# EAGLE design matchbox_cpu_v12 (EAGLE 7.2.0)
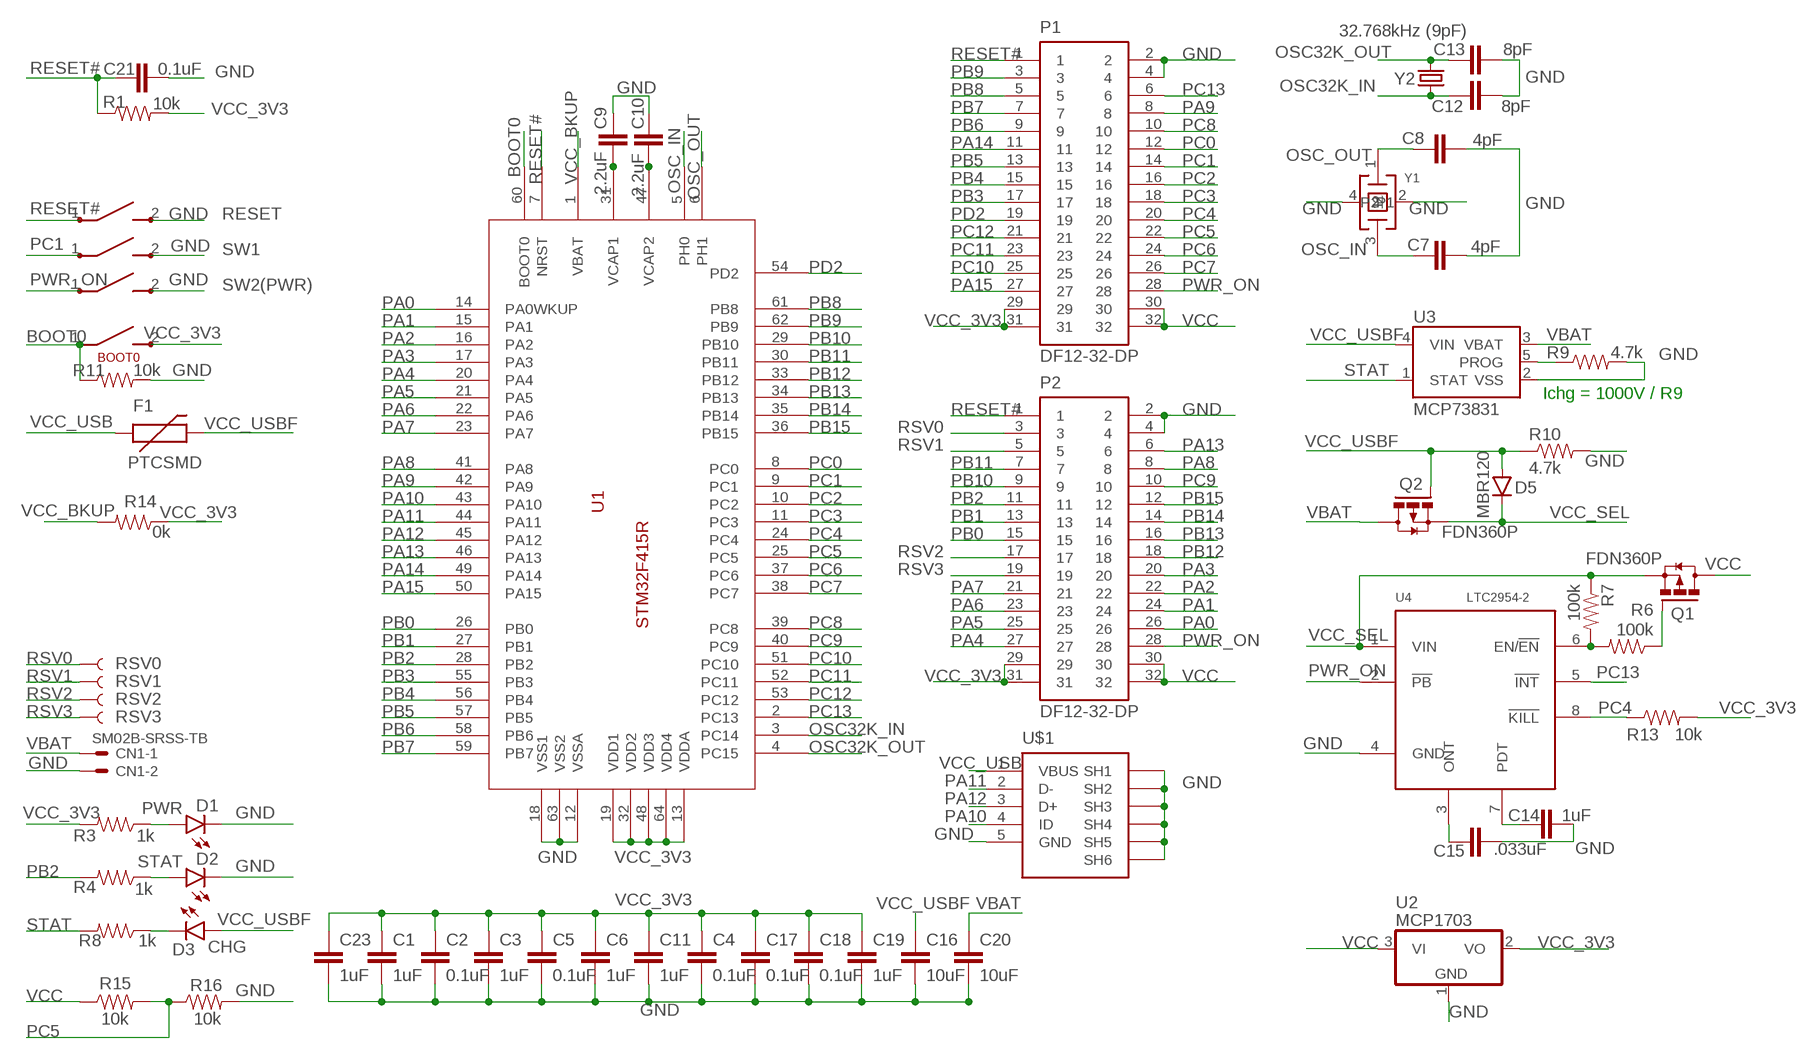
[diagram p0: schematic, sheet 1]

## Parts
BOOT0  B3U-3100PM-B  [B3U-3100PM-B]
C1  1uF  CAP0805  [0805]
C2  0.1uF  CAP0805  [0805]
C3  1uF  CAP0805  [0805]
C4  0.1uF  CAP0805  [0805]
C5  0.1uF  CAP0805  [0805]
C6  1uF  CAP0805  [0805]
C7  4pF  CAP0805  [0805]
C8  4pF  CAP0805  [0805]
C9  2.2uF  CAP0805  [0805]
C10  2.2uF  CAP0805  [0805]
C11  1uF  CAP0805  [0805]
C12  8pF  CAP0805  [0805]
C13  8pF  CAP0805  [0805]
C14  1uF  CAP0805  [0805]
C15  .033uF  CAP0805  [0805]
C16  10uF  CAP0805  [0805]
C17  0.1uF  CAP0805  [0805]
C18  0.1uF  CAP0805  [0805]
C19  1uF  CAP0805  [0805]
C20  10uF  CAP0805  [0805]
C21  0.1uF  CAP0805  [0805]
C23  1uF  CAP0805  [0805]
CN1  SM02B-SRSS-TB  [SM02B-SRSS-TB]
D1  PWR  LED0603  [LED-0603]
D2  STAT  LED0603  [LED-0603]
D3  CHG  LED0603  [LED-0603]
D5  MBR120  DIODESOD123  [SOD-123]
F1  PTCSMD  [PTC-1206]
P1  DF12-32-DP  AS-ITM-00015  [DF12-32-DP]
P2  DF12-32-DP  AS-ITM-00015  [DF12-32-DP]
Q1  FDN360P  [SUPER-SOT3]
Q2  FDN360P  [SUPER-SOT3]
R1  10k  RESISTOR0805-RES  [0805]
R3  1k  RESISTOR0805-RES  [0805]
R4  1k  RESISTOR0805-RES  [0805]
R6  100k  RESISTOR0805-RES  [0805]
R7  100k  RESISTOR0805-RES  [0805]
R8  1k  RESISTOR0805-RES  [0805]
R9  4.7k  RESISTOR0805-RES  [0805]
R10  4.7k  RESISTOR0805-RES  [0805]
R11  10k  RESISTOR0805-RES  [0805]
R13  10k  RESISTOR0805-RES  [0805]
R14  0k  RESISTOR0805-RES  [0805]
R15  10k  RESISTOR0805-RES  [0805]
R16  10k  RESISTOR0805-RES  [0805]
RESET  B3U-3100PM-B  [B3U-3100PM-B]
RSV0  TEST-POINT3  [PAD.03X.03]
RSV1  TEST-POINT3  [PAD.03X.03]
RSV2  TEST-POINT3  [PAD.03X.03]
RSV3  TEST-POINT3  [PAD.03X.03]
SW1  B3U-3100PM-B  [B3U-3100PM-B]
SW2(PWR)  B3U-3100PM-B  [B3U-3100PM-B]
U1  STM32F415R  STM32F4R_64PIN_FOXCAR  [LQFP64]
U2  MCP1703  [SOT23A]
U3  MCP73831  [SOT23-5]
U4  LTC2954-2  LTC2954  [SOT23-8]
U$1  MICROUSB  [MICROUSB]
Y1  16MHz(9pF)  AS-ITM-00228  [ABM11]
Y2  32.768kHz (9pF)  CRYSTALEPSONMC146  [CRYSTAL-32KHZ-SMD_EPSON_MC146]

## Nets
BOOT0: BOOT0.1 R11.1 U1.60(BOOT0)
GND: C1.2 C2.2 C3.2 C4.2 C5.2 C6.2 C7.2 C8.2 C9.1 C10.1 C11.2 C12.2 C13.2 C14.2 C15.2 C16.2 C17.2 C18.2 C19.2 C20.2 C21.2 C23.2 CN1.2 D1.C D2.C P1.2 P1.4 P2.2 P2.4 R9.2 R10.2 R11.2 R16.2 RESET.2 SW1.2 SW2(PWR).2 U1.12(VSSA) U1.18(VSS1) U1.63(VSS2) U2.1(GND) U3.2(VSS) U4.4(GND) U$1.5(GND) U$1.6(SH1) U$1.7(SH2) U$1.8(SH3) U$1.9(SH4) U$1.10(SH5) U$1.11(SH6) Y1.2 Y1.4(P1)
N$1: C9.2 U1.31(VCAP1)
N$2: C10.2 U1.47(VCAP2)
N$3: C15.1 U4.3(ONT)
N$4: C14.1 U4.7(PDT)
N$5: D1.A R3.1
N$6: D2.A R4.1
N$7: D3.C R8.1
N$8: R6.2 R7.2 U4.6(EN/!EN!)
N$9: Q1.1(G) R6.1
N$11: R9.1 U3.5(PROG)
OSC32K_IN: C12.1 U1.3(PC14) Y2.P$2
OSC32K_OUT: C13.1 U1.4(PC15) Y2.P$1
OSC_IN: C7.1 U1.5(PH0) Y1.3
OSC_OUT: C8.1 U1.6(PH1) Y1.1
PA0: P2.26 U1.14(PA0WKUP)
PA1: P2.24 U1.15(PA1)
PA2: P2.22 U1.16(PA2)
PA3: P2.20 U1.17(PA3)
PA4: P2.27 U1.20(PA4)
PA5: P2.25 U1.21(PA5)
PA6: P2.23 U1.22(PA6)
PA7: P2.21 U1.23(PA7)
PA8: P2.8 U1.41(PA8)
PA9: P1.8 U1.42(PA9)
PA10: U1.43(PA10) U$1.4(ID)
PA11: U1.44(PA11) U$1.2(D-)
PA12: U1.45(PA12) U$1.3(D+)
PA13: P2.6 U1.46(PA13)
PA14: P1.11 U1.49(PA14)
PA15: P1.27 U1.50(PA15)
PB0: P2.15 U1.26(PB0)
PB1: P2.13 U1.27(PB1)
PB2: P2.11 R4.2 U1.28(PB2)
PB3: P1.17 U1.55(PB3)
PB4: P1.15 U1.56(PB4)
PB5: P1.13 U1.57(PB5)
PB6: P1.9 U1.58(PB6)
PB7: P1.7 U1.59(PB7)
PB8: P1.5 U1.61(PB8)
PB9: P1.3 U1.62(PB9)
PB10: P2.9 U1.29(PB10)
PB11: P2.7 U1.30(PB11)
PB12: P2.18 U1.33(PB12)
PB13: P2.16 U1.34(PB13)
PB14: P2.14 U1.35(PB14)
PB15: P2.12 U1.36(PB15)
PC0: P1.12 U1.8(PC0)
PC1: P1.14 SW1.1 U1.9(PC1)
PC2: P1.16 U1.10(PC2)
PC3: P1.18 U1.11(PC3)
PC4: P1.20 R13.1 U1.24(PC4) U4.8(!KILL!)
PC5: P1.22 R15.2 R16.1 U1.25(PC5)
PC6: P1.24 U1.37(PC6)
PC7: P1.26 U1.38(PC7)
PC8: P1.10 U1.39(PC8)
PC9: P2.10 U1.40(PC9)
PC10: P1.25 U1.51(PC10)
PC11: P1.23 U1.52(PC11)
PC12: P1.21 U1.53(PC12)
PC13: P1.6 U1.2(PC13) U4.5(!INT!)
PD2: P1.19 U1.54(PD2)
PWR_ON: P1.28 P2.28 SW2(PWR).1 U4.2(!PB!)
RESET#: C21.1 P1.1 P2.1 R1.1 RESET.1 U1.7(NRST)
RSV0: P2.3 RSV0.P$1
RSV1: P2.5 RSV1.P$1
RSV2: P2.17 RSV2.P$1
RSV3: P2.19 RSV3.P$1
STAT: R8.2 U3.1(STAT)
VBAT: C20.1 CN1.1 Q2.3(D) U3.3(VBAT)
VCC: P1.30 P1.32 P2.30 P2.32 Q1.3(D) R15.1 U2.3(VI)
VCC_3V3: BOOT0.2 C1.1 C2.1 C3.1 C4.1 C5.1 C6.1 C11.1 C17.1 C18.1 C19.1 C23.1 P1.29 P1.31 P2.29 P2.31 R1.2 R3.2 R13.2 R14.1 U1.13(VDDA) U1.19(VDD1) U1.32(VDD2) U1.48(VDD3) U1.64(VDD4) U2.2(VO)
VCC_BKUP: R14.2 U1.1(VBAT)
VCC_SEL: D5.C Q1.2(S) Q2.2(S) R7.1 U4.1(VIN)
VCC_USB: F1.1 U$1.1(VBUS)
VCC_USBF: C16.1 D3.A D5.A F1.2 Q2.1(G) R10.1 U3.4(VIN)

## Notes on the sheet
- Ichg = 1000V / R9

## Power pins joined to a net without a drawn wire
GND: BOOT0.GND RESET.GND SW1.GND SW2(PWR).GND

## Library data of the parts
BOOT0 RESET SW1 SW2(PWR) = sharp_display:B3U-3100PM-B
C1-C21 C23 = SparkFun-Capacitors:CAP: Capacitor Standard 0603 ceramic capacitor, and 0.1" leaded capacitor.
CN1 = con-jst2:?M02B-SRSS-TB: Disconnectable Crimp style connector, 1.0mm pitch 2 contacts
D1-D3 = SparkFun-LED:LED: LEDs Standard schematic elements and footprints for 5mm, 3mm, 1206, and 0603 sized LEDs. 5mm - Spark Fun Electronics SKU : COM-00529 (and others)
D5 = SparkFun-DiscreteSemi:DIODE: Diode These are standard reverse protection diodes and small signal diodes. SMA package can handle up to about 1A. SOD-323 can handle about 200mA. What the SOD-323 package when ordering, there are some mfgs out there that are 5-pin packages.
F1 = SparkFun-PowerIC:PTC: Resettable Fuse PTC Resettable Fuse. Spark Fun Electronics SKU : COM-08357; PROD_ID: RES-11150
P1 P2 = micro1292:AS-ITM-00015: CONN HEADER 32POS 3MM SMD 0.5MM; PARTNO: AS-ITM-00015
Q1 Q2 = transistor-power:FDN360P: Single P-Channel, PowerTrench (R) MOSFET Source: http://www.fairchildsemi.com/ds/FD/FDN360P.pdf
R1 R3 R4 R6-R11 R13-R16 = SparkFun-Passives:RESISTOR: Resistor Basic schematic elements and footprints for 0603, 1206, and PTH resistors.
RSV0 RSV1-RSV3 = SparkFun-Passives:TEST-POINT: Bare copper test points for troubleshooting or ICT
U1 = stm32f4:STM32F4R_64PIN_FOXCAR: 64-pin STM32F4 chip with symbol for Foxcar Control Board v1.
U2 = linear:MCP1703: 250 mA, 16V, Low Quiescent Current LDO Regulator Source: http://ww1.microchip.com/downloads/en/DeviceDoc/22049b.pdf
U3 = SparkFun-PowerIC:MCP73831: Miniature single cell, fully integrated Li-Ion, Li-polymer charge management controller http://ww1.microchip.com/downloads/en/DeviceDoc/20001984g.pdf IC-09995; PROD_ID: IC-09995
U4 = GeekAmmo:LTC2954: LTC2954 Push Button On/Off Controller with uP Interrupt The LTC®2954 is a pushbutton on/off controller that manages system power via a pushbutton interface. http://www.linear.com/docs/16598
U$1 = jimduino:MICROUSB
Y1 = micro1292:AS-ITM-00228: CRYSTAL 16MHZ 8PF SMD; PARTNO: AS-ITM-00228; VALUE: 8Y-16.000MAAV-T
Y2 = SparkFun-FreqCtrl:CRYSTAL: Various standard crystals. Proven footprints.

## Board
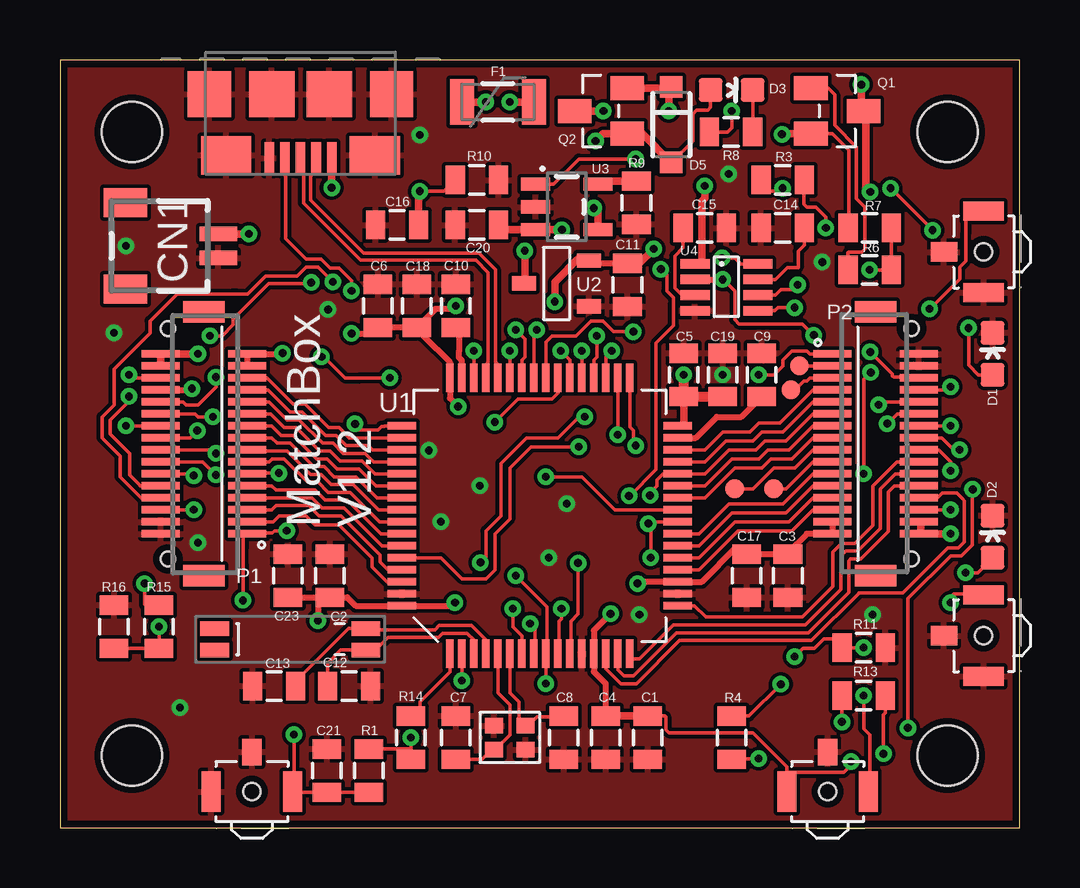
[diagram p1: board, top side]
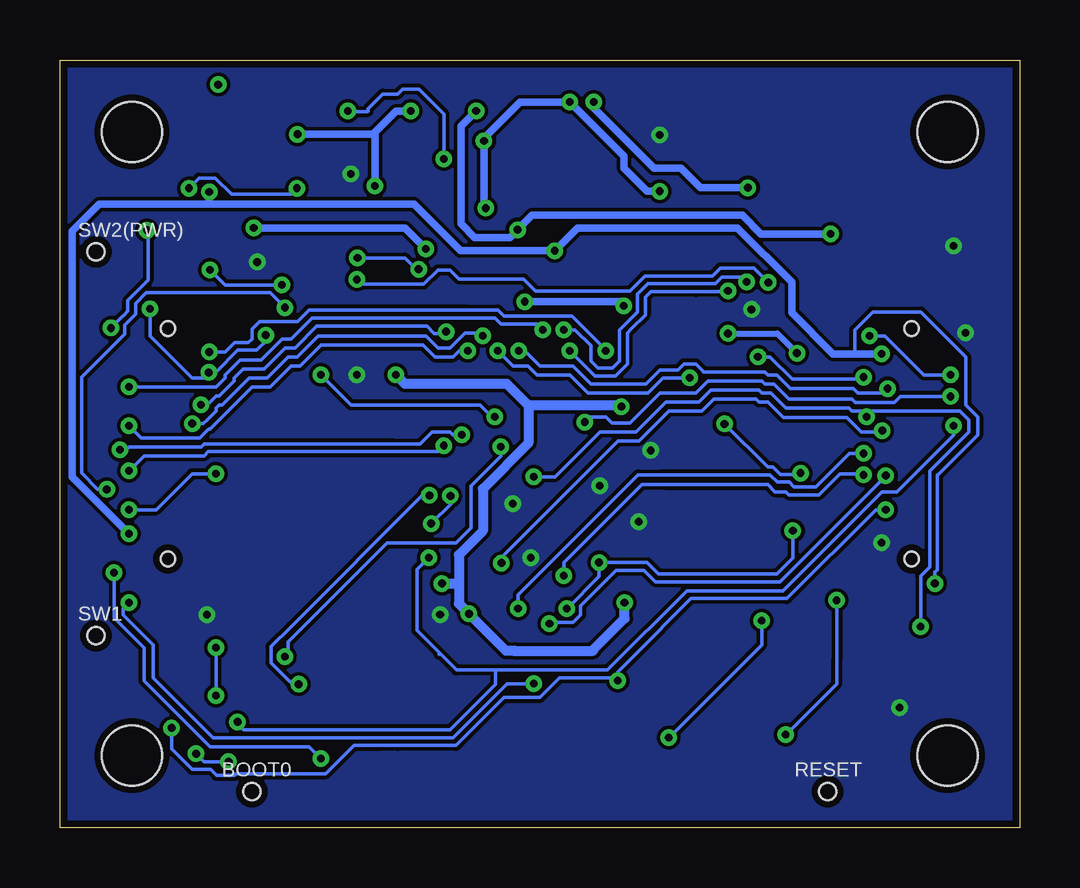
[diagram p2: board, bottom side, seen from below]

Size 40 x 32 mm. Coordinates in mm from the lower left corner, seen from the top.
Outline: 0,0 40,0 40,32 0,32 0,0
Copper layers (1*16): Top 0.0356mm / dielectric 1.5011mm / Bottom 0.0356mm
Design rules "LaenPCBOrder (2) *": minimum track width 6mil, minimum drill 13mil, track to track 6mil, track to pad 6mil, pad to pad 6mil, via to via 6mil, smd to smd 6mil, copper to edge 12mil, drill to drill 6mil, minimum pad ring 7mil, minimum via ring 7mil, stop-mask expansion 14mil, vias tented up to drill 14mil, thermal gap 6mil
Holes 2.5 mm at 3,29 37,29 37,3 3,3

### Footprints (pad centres in the part's own frame; a part is rotated, then mirrored left to right if it is on the bottom)
B3U-3100PM-B = smd 0.8 x 1.7: 1 -1.7,0; 2 1.7,0 | smd 0.8 x 1.1: GND 0,-1.65 | hole 0.7: 0,0
0805 = smd 0.8 x 1.2: 1 -0.9,0; 2 0.9,0
SM02B-SRSS-TB = smd 0.6 x 1.55: 1 -0.5,2.975; 2 0.5,2.975 | smd 1.2 x 1.8: FIT@1 -1.8,-0.9; FIT@2 1.8,-0.9
LED-0603 = smd 1 x 1: A 0,-0.877; C 0,0.877
SOD-123 = smd 0.9 x 0.95: A 1.575,0; C -1.575,0
PTC-1206 = smd 1 x 1.9: 1 -1.5,0; 2 1.5,0
DF12-32-DP = smd 0.3 x 1.6: 1 -3.75,-1.8; 2 -3.75,1.8; 3 -3.25,-1.8; 4 -3.25,1.8; 5 -2.75,-1.8; 6 -2.75,1.8; 7 -2.25,-1.8; 8 -2.25,1.8; 9 -1.75,-1.8; 10 -1.75,1.8; 11 -1.25,-1.8; 12 -1.25,1.8; 13 -0.75,-1.8; 14 -0.75,1.8; 15 -0.25,-1.8; 16 -0.25,1.8; 17 0.25,-1.8; 18 0.25,1.8; 19 0.75,-1.8; 20 0.75,1.8; 21 1.25,-1.8; 22 1.25,1.8; 23 1.75,-1.8; 24 1.75,1.8; 25 2.25,-1.8; 26 2.25,1.8; 27 2.75,-1.8; 28 2.75,1.8; 29 3.25,-1.8; 30 3.25,1.8; 31 3.75,-1.8; 32 3.75,1.8 | smd 0.889 x 1.727: F1 -5.5,0; F2 5.5,0 | hole 0.6: -4.8,1.5; 4.8,1.5
SUPER-SOT3 = smd 1 x 1.4: 1 -0.95,-1.1; 2 0.95,-1.1; 3 0,1.1
PAD.03X.03 = smd 0.762 x 0.762: P$1 0,0
LQFP64 = smd 0.3 x 1.2: 1 -3.75,-5.75; 2 -3.25,-5.75; 3 -2.75,-5.75; 4 -2.25,-5.75; 5 -1.75,-5.75; 6 -1.25,-5.75; 7 -0.75,-5.75; 8 -0.25,-5.75; 9 0.25,-5.75; 10 0.75,-5.75; 11 1.25,-5.75; 12 1.75,-5.75; 13 2.25,-5.75; 14 2.75,-5.75; 15 3.25,-5.75; 16 3.75,-5.75; 33 3.75,5.75; 34 3.25,5.75; 35 2.75,5.75; 36 2.25,5.75; 37 1.75,5.75; 38 1.25,5.75; 39 0.75,5.75; 40 0.25,5.75; 41 -0.25,5.75; 42 -0.75,5.75; 43 -1.25,5.75; 44 -1.75,5.75; 45 -2.25,5.75; 46 -2.75,5.75; 47 -3.25,5.75; 48 -3.75,5.75 | smd 1.2 x 0.3: 17 5.75,-3.75; 18 5.75,-3.25; 19 5.75,-2.75; 20 5.75,-2.25; 21 5.75,-1.75; 22 5.75,-1.25; 23 5.75,-0.75; 24 5.75,-0.25; 25 5.75,0.25; 26 5.75,0.75; 27 5.75,1.25; 28 5.75,1.75; 29 5.75,2.25; 30 5.75,2.75; 31 5.75,3.25; 32 5.75,3.75; 49 -5.75,3.75; 50 -5.75,3.25; 51 -5.75,2.75; 52 -5.75,2.25; 53 -5.75,1.75; 54 -5.75,1.25; 55 -5.75,0.75; 56 -5.75,0.25; 57 -5.75,-0.25; 58 -5.75,-0.75; 59 -5.75,-1.25; 60 -5.75,-1.75; 61 -5.75,-2.25; 62 -5.75,-2.75; 63 -5.75,-3.25; 64 -5.75,-3.75
SOT23A = smd 0.6 x 1: 1 -0.95,-1.3; 2 0.95,-1.3; 3 0,1.4
SOT23-5 = smd 0.55 x 1.2: 1 -0.95,-1.3; 2 0,-1.3; 3 0.95,-1.3; 4 0.95,1.3; 5 -0.95,1.3
SOT23-8 = smd 0.4 x 1.22: 1 0,0; 2 0.65,0; 3 1.3,0; 4 1.95,0; 5 1.95,2.62; 6 1.3,2.62; 7 0.65,2.62; 8 0,2.62
MICROUSB = smd 0.4 x 1.35: 1 -1.3,2.675; 2 -0.65,2.675; 3 0,2.675; 4 0.65,2.675; 5 1.3,2.675 | smd 2.1 x 1.6: 6 -3.1,2.55; 7 3.1,2.55 | smd 1.8 x 1.9: 8 -3.8,0; 11 3.8,0 | smd 1.9 x 1.9: 9 -1.2,0; 10 1.2,0
ABM11 = smd 0.75 x 0.65: 1 -0.65,-0.5; 2 0.65,-0.5; 3 0.65,0.5; 4 -0.65,0.5
CRYSTAL-32KHZ-SMD_EPSON_MC146 = smd 1.2 x 0.6: NC1 6.9,1.2; NC2 6.9,0.3; P$1 0.6,0.3; P$2 0.6,1.2

### Placement (x,y rotation side)
BOOT0  32,1.5 180 top
C1  24.5,3.75 270 top
C2  11.25,10.5 90 top
C3  30.34,10.5 270 top
C4  22.75,3.75 270 top
C5  26,18.88 90 top
C6  13.25,21.75 90 top
C7  16.5,3.75 90 top
C8  21,3.75 270 top
C9  29.25,18.88 270 top
C10  16.5,21.75 270 top
C11  23.65,22.62 270 top
C12  12.05,5.9 0 top
C13  8.93,5.9 180 top
C14  30.12,25 180 top
C15  26.88,25 0 top
C16  14.05,25.12 180 top
C17  28.62,10.5 270 top
C18  14.88,21.75 90 top
C19  27.62,18.88 90 top
C20  17.38,25.12 180 top
C21  11.12,2.38 90 top
C23  9.5,10.5 90 top
CN1  3.62,24.25 270 top
D1  38.88,19.75 0 top
D2  38.88,12.12 0 top
D3  28,30.75 270 top
D5  25.48,29.3 270 top
F1  18.25,30.25 0 top
P1  6,16 90 top
P2  34,16 270 top
Q1  32.4,29.88 270 top
Q2  22.55,29.88 90 top
R1  12.88,2.38 90 top
R3  30.12,27 0 top
R4  28,3.75 90 top
R6  33.75,23.25 0 top
R7  33.75,25 0 top
R8  27.98,29 180 top
R9  24.02,26.05 270 top
R10  17.38,27 0 top
R11  33.5,7.5 0 top
R13  33.5,5.5 0 top
R14  14.62,3.75 90 top
R15  4.12,8.38 270 top
R16  2.25,8.38 90 top
RESET  8,1.5 180 top
RSV0  30.82,19.25 0 top
RSV1  30.48,18.25 0 top
RSV2  28.12,14.12 0 top
RSV3  29.75,14.12 0 top
SW1  38.5,8 270 top
SW2(PWR)  38.5,24 270 top
U1  20,13 0 top
U2  20.75,22.69 90 top
U3  21.12,25.88 270 top
U4  26.48,23.5 270 top
U$1  10.03,30.57 180 top
Y1  18.75,3.75 180 top
Y2  13.35,8.6 180 top

### Tracks (layer width: path | path; a pad name or v marks a point on that pad's centre or on a via)
BOOT0  (via drill 0.33)
  Top 0.152: 14.2,11.3 U1.60 15.88,11.25 16.75,10.38 17.75,10.38 18.12,10.75 18.12,12.25 18.75,12.88 18.75,15 19.62,15.88 v21.62,15.88 | v30.62,7.12 30.75,7.25 30.98,7.47 31.45,7.47 31.85,7.88 32.23,7.88 R11.1 32.62,7.5 v33.5,7.5 | 33.5,4.12 v33.5,5.5 | 33.75,3.88 33.5,4.12 | 33.75,3.88 33.75,2 33.75,1.55 BOOT0.1 | 33.75,3.88 33.5,4.12
  Bottom 0.152: v21.62,15.88 21.62,15.5 22.88,14.25 22.88,12.5 23.5,11.88 26.38,11.88 30.5,7.75 30.5,7.25 v30.62,7.12 | v33.5,5.5 v33.5,7.5
GND  (via drill 0.33)
  other vias: 21.12,13.5 5,5 2.75,24.25 24.15,8.88 33.88,8.88 27.62,18.88 20.38,11.25 15.38,15.72 15.88,12.75 2.25,20.62 5.75,11.88 17.5,14.25 15,28.88 11.18,21.6 27.88,27.25 31.77,23.57
  pour Top: 0,0 40,0 40,32 0,32
  pour Bottom: 0,0 40,0 40,32 0,32
N$1
  Top 0.254: U1.31 26.5,16.25 27.38,17.12 28.4,17.12 C9.2
N$2
  Top 0.254: C10.2 16.6,20.85 16.62,20.82 16.62,19.85 16.62,19.6 16.75,19.48 U1.47
N$3
  Top 0.152: 26,24.98 C15.1 25.98,24.18 25.62,23.82 25.62,22.5 25.93,22.2 U4.3
N$4
  Top 0.152: 31,25 C14.1 31.02,24.93 31.02,24.27 30.77,24.02 30.77,23.35 30.32,23.35 29.82,22.85 U4.7
N$5  (via drill 0.33)
  Top 0.152: R3.1 29.23,26.52 30,26.52 v30.12,26.65 | v36.38,24.9 v34.62,26.65 | v37.88,20.82 37.88,19.27 38.27,18.88 D1.A
  Bottom 0.152: v37.88,20.82 37.4,21.3 37.35,21.35 37.17,21.52 37.17,21.98 36.33,22.82 36.33,24.85 v36.38,24.9 | v30.12,26.65 30.38,26.4 32.8,26.4 32.85,26.4 33.52,27.07 34.2,27.07 v34.62,26.65
N$6  (via drill 0.33)
  Top 0.152: v37.75,10.62 38.25,10.62 D2.A | v29.12,2.88 28.02,2.88 R4.1
  Bottom 0.152: v29.12,2.88 29.62,3.38 31.38,3.38 33.75,3.38 36.5,6.12 36.5,7.5 37.38,8.38 37.75,8.75 v37.75,10.62
N$7
  Top 0.152: D3.C R8.1
N$8  (via drill 0.33)
  Top 0.152: v33.75,23.25 34.5,23.25 34.62,23.12 34.75,23.25 R6.2 34.65,23.32 R7.2 | U4.6 29.82,22.2 30.05,22.43 30.18,22.43 30.55,22.43 v30.75,22.62
  Bottom 0.152: v33.75,23.25 33.12,22.62 v30.75,22.62
N$9
  Top 0.152: Q1.1 32.02,30.82 32.3,30.55 32.3,29.27 33.2,28.38 33.2,26.23 33.55,25.88 33.55,24.12 33.42,24 32.88,24 32.85,23.98 R6.1
N$11
  Top 0.305: U3.5 22.55,26.95 R9.1
OSC32K_IN
  Top 0.152: U1.3 17.25,7.83 16.98,8.1 15.95,8.1 15.78,7.92 15.75,7.92 13.68,7.92 13.15,7.4 Y2.P$2 | 12.75,7.38 Y2.P$2 | C12.1 11.15,6.85 11.7,7.4 Y2.P$2
OSC32K_OUT
  Top 0.152: 17.8,7.3 U1.4 | Y2.P$1 12.75,8.43 | 12.88,8.12 12.88,8.25 | 12.88,8.25 12.75,8.38 Y2.P$1 | 12.88,8.25 13.12,8.25 13.25,8.25 15.62,8.25 15.8,8.43 17.15,8.43 17.75,7.82 U1.4 | 17.75,7.35 U1.4 | C13.1 9.82,6.1 10.53,6.8 12.03,8.3 Y2.P$1
OSC_IN
  Top 0.152: U1.5 18.25,5.62 18.75,5.12 18.75,4 18.75,3.88 18.25,3.38 18.25,3.25 18.12,3.25 Y1.3 18,3.25 17.6,2.85 C7.1
OSC_OUT
  Top 0.152: U1.6 18.75,5.62 19.12,5.25 19.12,4.5 19.38,4.25 Y1.1 19.5,4.25 19.88,4.62 21,4.62 C8.1
PA0
  Top 0.152: U1.14 22.75,6.62 23.38,6 24.02,6 25.82,7.8 31.32,7.8 33.27,9.75 33.3,9.78 35.12,9.78 37,11.65 37.45,11.65 37.7,11.9 37.7,13.62 37.62,13.7 37.38,13.95 36.85,13.95 36.77,13.95 36.58,13.75 35.83,13.75 P2.26
PA1
  Top 0.152: P2.24 34.77,14.25 34.52,14 34.52,12.35 33.38,11.2 32.95,11.2 32.88,11.12 32.88,9.8 31.2,8.12 25.7,8.12 24.2,6.62 23.9,6.33 23.5,6.33 23.25,6.58 U1.15
PA2
  Top 0.152: 35.75,14.75 P2.22 34.83,14.75 34.2,14.12 34.2,12.47 33.25,11.53 32.75,11.53 32.55,11.32 32.55,9.93 31.07,8.45 31,8.45 25.57,8.45 24.15,7.03 24.02,7.03 23.77,7.03 23.75,7.05 U1.16
PA3
  Top 0.152: P2.20 34.88,15.25 33.88,14.25 33.88,12.6 33.12,11.85 32.58,11.85 32.23,11.49 32.23,10.05 30.95,8.78 26.93,8.78 26.45,9.25 U1.17
PA4
  Top 0.152: U1.20 26.62,10.75 28.25,12.38 30.5,12.38 31.38,13.25 32.12,13.25 P2.27
PA5
  Top 0.152: U1.21 26.62,11.25 28.12,12.75 30.38,12.75 31.38,13.75 32.12,13.75 P2.25
PA6
  Top 0.152: U1.22 26.62,11.75 28,13.12 30.25,13.12 31.38,14.25 32.12,14.25 P2.23
PA7
  Top 0.152: U1.23 26.62,12.25 27.88,13.5 30.12,13.5 31.38,14.75 32.12,14.75 P2.21
PA8  (via drill 0.33)
  Top 0.152: v37.12,18.38 37,18.25 P2.8 | U1.41 19.75,20.38 19.75,20.62 v19.88,20.75
  Bottom 0.152: v37.12,18.38 33.5,18.38 33.12,18.75 33.12,18.88 32.5,19.5 31.62,19.5 30.75,20.38 30.38,20.38 29.5,21.25 21.88,21.25 21.62,21 20.12,21 v19.88,20.75
PA9  (via drill 0.33)
  Top 0.152: 4.17,13.75 P1.8 4.12,13.75 3.38,13.75 2.5,14.62 2.5,15.5 1.75,16.25 1.75,17.12 2.25,17.62 2.25,19.12 3.75,20.62 3.75,21.12 4.88,22.25 7.2,22.25 7.35,22.25 7.83,22.25 8.15,22.57 8.57,23 8.62,23 9.88,23 10.25,23.38 10.75,23.38 v11.38,22.75 | U1.42 19.25,19.5 19.38,19.62 19.38,19.75 19.38,20 19.38,20.38 v19,20.75
  Bottom 0.152: v11.38,22.75 11.57,22.95 12.4,22.95 12.68,22.68 13.57,22.68 13.65,22.68 15.5,22.68 15.93,22.25 15.93,21.5 16.68,20.75 16.68,20.68 16.68,19.45 16.98,19.15 17.57,19.15 17.88,19.45 17.88,20.07 17.88,20.1 18.52,20.75 v19,20.75
PA10  (via drill 0.33)
  Top 0.152: U1.43 18.75,19.62 v18.75,19.88 | 9.38,27.88 U$1.4 | 9.38,27.8 U$1.4 | U$1.4 9.38,27.73 9.38,27.18 9.4,27.15 9.4,24.55 10.25,23.7 10.88,23.7 11.25,23.32 11.62,23.32 12.15,22.8 v12.15,22.38
  Bottom 0.152: v18.75,19.88 17.75,18.88 17.7,18.82 16.85,18.82 16.8,18.88 16.35,19.32 16.35,20.62 16.18,20.8 15.6,21.38 15.6,22.12 15.38,22.35 13.53,22.35 13.45,22.35 12.18,22.35 v12.15,22.38
PA11
  Top 0.152: U1.44 18.25,19.3 18.15,19.4 18.15,23.26 17.46,23.95 12.66,23.95 10.45,26.16 10.45,27.15 10.68,27.38 U$1.2
PA12
  Top 0.152: U1.45 17.75,19.3 17.85,19.4 17.85,23.14 17.34,23.65 12.54,23.65 10.15,26.04 10.15,28.1 10.03,27.98 U$1.3
PA13  (via drill 0.33)
  Top 0.152: 17.3,18.8 U1.46 v17.25,19.88 | v33.77,19.82 34.7,18.9 34.7,18.82 34.75,18.77 35.08,18.77 35.1,18.75 P2.6 | P2.6
  Bottom 0.152: v17.25,19.88 17.25,19.93 17.57,20.25 18.65,21.32 21.5,21.32 21.73,21.55 21.75,21.57 23.1,21.57 23.18,21.57 29.62,21.57 30.1,21.1 31.68,21.1 32,20.77 32,20.38 32.15,20.23 32.73,20.23 33.12,19.82 v33.77,19.82
PA14  (via drill 0.33)
  Top 0.152: v12.3,16.82 12.22,16.75 12.4,16.57 13.25,16.57 13.4,16.73 13.5,16.73 13.53,16.75 U1.49 | v9.12,14.78 8.55,14.78 8.53,14.75 7.83,14.75 P1.11
  Bottom 0.152: v12.3,16.82 10.5,15.03 10.28,15.03 9.97,14.72 9.18,14.72 v9.12,14.78
PA15
  Top 0.152: U1.50 12.05,16.25 11.62,16.68 11.2,16.68 10.22,17.65 9.72,17.65 8.62,18.75 7.83,18.75 P1.27
PB0
  Top 0.152: U1.26 26.88,13.75 28.12,15 29.25,15 29.62,15.38 30.5,15.38 31.38,16.25 32.12,16.25 P2.15
PB1
  Top 0.152: P2.13 32.12,16.75 31.38,16.75 30.5,15.88 30.38,15.75 29.5,15.75 29.12,15.38 28,15.38 26.88,14.25 U1.27
PB2  (via drill 0.33)
  Top 0.152: P2.11 31.38,17.25 30.25,16.12 29.38,16.12 29,15.75 27.88,15.75 26.88,14.75 U1.28 25.12,14.75 24.88,14.5 24.88,14.25 24.6,13.97 v24.6,13.85 | v30.05,5.97 28.73,4.65 R4.2
  Bottom 0.152: v24.6,13.85 24.9,13.85 30.38,8.38 31.2,7.55 31.2,6.88 30.3,5.97 30.1,5.97 v30.05,5.97
PB3
  Top 0.152: U1.55 13.22,13.75 12.35,14.62 11.43,14.62 11,15.05 10.57,15.05 9.6,16.02 9.05,16.02 8.82,16.25 7.83,16.25 P1.17
PB4
  Top 0.152: U1.56 13.28,13.25 12.22,14.3 11.3,14.3 10.88,14.72 10.45,14.72 9.47,15.7 8.57,15.7 8.53,15.75 7.83,15.75 P1.15
PB5
  Top 0.152: P1.13 7.83,15.25 8.72,15.25 8.85,15.38 9.35,15.38 10.32,14.4 10.75,14.4 11.18,13.97 11.43,13.97 12.1,13.97 13.32,12.75 U1.57
PB6
  Top 0.152: P1.9 7.83,14.25 8.82,14.25 9,14.07 10.62,14.07 11.05,13.65 11.97,13.65 12.82,12.8 13.38,12.25 U1.58
PB7
  Top 0.152: 7.81,13.75 P1.7 7.88,13.75 10.5,13.75 10.93,13.32 11.85,13.32 13.43,11.75 U1.59
PB8
  Top 0.152: P1.5 7.83,13.25 8.82,13.25 9,13.43 10.38,13.43 10.8,13 11.72,13 13.35,11.38 13.35,11.32 13.35,11.07 13.68,10.75 U1.61
PB9
  Top 0.152: P1.3 7.88,12.75 8.88,12.75 9.12,13 10.25,13 10.62,12.62 11.62,12.62 13,11.25 13,10.88 13.62,10.25 U1.62
PB10
  Top 0.152: U1.29 26.88,15.25 27.75,16.12 28.88,16.12 29.25,16.5 30.12,16.5 31.38,17.75 32.12,17.75 P2.9
PB11
  Top 0.152: P2.7 31.38,18.25 30,16.88 29.12,16.88 28.75,16.5 27.62,16.5 26.88,15.75 U1.30
PB12  (via drill 0.33)
  Top 0.152: U1.33 23.75,16.7 23.9,16.55 23.9,16.02 v24,15.93 | v37.12,14.88 37.12,15.25 36.62,15.75 P2.18
  Bottom 0.152: v37.12,14.88 36.5,15.5 34,15.5 33.83,15.68 24.25,15.68 v24,15.93
PB13  (via drill 0.33)
  Top 0.152: U1.34 23.25,16.43 v23.25,16.38 | 35.75,16.25 P2.16 36.75,16.25 37.25,15.75 v37.5,15.75
  Bottom 0.152: 32.8,16 26.12,16 26.1,16 25,16 24.5,16.5 23.75,16.5 23.62,16.38 23.38,16.38 v23.25,16.38 | v37.5,15.75 37.25,15.75 37.12,15.88 34.38,15.88 34.12,15.88 34,16 32.88,16 | 32.88,16 32.8,16 | 32.88,16 32.8,16
PB14  (via drill 0.33)
  Top 0.152: v23,19.88 22.75,19.62 U1.35 | P2.14 v37.12,16.75
  Bottom 0.152: v37.12,16.75 36.62,16.25 34.17,16.25 33.8,16.62 33.75,16.62 32,18.38 31.25,18.38 30.38,19.25 30,19.25 29.12,20.12 24.88,20.12 24.38,19.62 23.62,19.62 23.38,19.88 v23,19.88
PB15  (via drill 0.33)
  Top 0.152: P2.12 35,17.25 34.9,17.25 v34.49,16.84 | v22.38,20.5 22.38,19.62 22.25,19.5 U1.36
  Bottom 0.152: v22.38,20.5 22.5,20.62 23.12,20.62 23.75,20 24.25,20 24.75,20.5 29.25,20.5 30.12,19.62 30.5,19.62 31.38,18.75 31.75,18.75 32.12,18.75 33.25,17.62 33.38,17.62 33.5,17.5 33.5,17.38 33.88,17 34.04,16.84 v34.49,16.84
PC0  (via drill 0.33)
  Top 0.152: v19.6,8.5 19.8,8.3 19.8,7.3 U1.8 | P1.12 5.5,14.75 v5.58,14.68
  Bottom 0.152: v5.58,14.68 5.62,14.62 10,10.25 15.18,10.25 15.28,10.35 15.65,10.72 16.82,10.72 18.3,9.25 18.3,8.88 18.62,8.55 19.55,8.55 v19.6,8.5
PC1  (via drill 0.33)
  Top 0.152: v19,10.5 20.2,9.3 20.3,9.2 20.3,7.3 U1.9 v20.25,6 | P1.14 5.95,15.25 v6.5,14.7 | v37.12,9.38 37.12,9.62 37.25,9.75 38.5,9.75 SW1.1
  Bottom 0.152: v6.5,14.7 6.5,14.75 7.5,14.75 8.38,13.88 9.62,13.88 9.75,14 10.12,14 10.2,14 10.5,14.3 14.6,14.3 14.7,14.3 15.75,14.3 19,11.05 v19,10.5 | v37.12,9.38 37.38,9.12 37.38,8.88 36.12,7.62 36.12,6.25 33.62,3.75 27.88,3.75 26.18,3.75 23.62,3.75 21.62,5.75 21.38,6 v20.25,6
PC2  (via drill 0.33)
  Top 0.152: U1.10 20.8,7.3 20.8,8.6 20.9,8.7 v20.9,9.12 20.9,9.3 | P1.16 6.35,15.75 v6.5,15.6
  Bottom 0.152: v20.9,9.12 20.9,9.7 15.9,14.7 14.9,14.7 14.7,14.7 10.4,14.7 10.1,14.4 9.6,14.4 9.4,14.2 8.5,14.2 7.1,15.6 v6.5,15.6
PC3  (via drill 0.33)
  Top 0.152: U1.11 21.3,7.3 21.3,8.6 21.6,8.9 v21.6,11.03 | P1.18 5.42,16.25 v5.72,16.55
  Bottom 0.152: v21.6,11.03 21.62,11 21.62,11.25 16.75,16.12 15.88,16.12 14.62,17.38 13.25,17.38 12.75,17.88 11,17.88 10.88,17.75 10.5,17.75 9.85,17.1 7.2,17.1 6.6,16.5 5.78,16.5 v5.72,16.55
PC4  (via drill 0.33)
  Top 0.152: P1.20 v2.75,16.75 | v23.73,13.82 23.75,13.82 24.85,14.93 24.85,20.2 25.57,20.93 25.57,21.88 25.57,22.1 25.3,22.38 25.3,23.02 v25.05,23.27 | v27.6,23.75 28.12,23.75 28.38,23.5 29.07,23.5 U4.8 | R13.1 v32.6,4.4 | v24.62,11.25 24.62,12.57 v24.52,12.68 24.6,12.75 U1.24
  Bottom 0.152: 21.85,6.57 17.18,6.57 13.88,9.88 9.88,9.88 5.75,14 5.12,14 2.75,16.38 v2.75,16.75 | 21.85,6.57 23.47,6.57 24.16,7.26 | 24.16,7.26 25.12,8.22 25.12,10.75 v24.62,11.25 | 24.2,7.22 24.16,7.26 | v23.73,13.82 23.7,13.8 23.7,13.5 v24.52,12.68 | v25.05,23.27 25.07,23.3 25.12,23.25 25.62,23.75 v27.6,23.75 | 21.85,6.57 21.85,6.5 21.85,5.97 23.75,4.08 32.35,4.08 32.6,4.33 v32.6,4.4
PC5  (via drill 0.33)
  Top 0.152: U1.25 23.12,13.25 21.75,14.62 v20.25,14.62 | P1.22 5.62,17.25 5.75,17.12 v6.38,17.12 | v4.12,8.38 4.12,8.62 4.12,7.5 R15.2 R16.1
  Bottom 0.152: 6.62,17.38 7,17.38 7.12,17.5 9.75,17.5 10.38,18.12 10.75,18.12 10.88,18.25 12.88,18.25 13.38,17.75 14.75,17.75 16,16.5 17.12,16.5 17.5,16.5 18.25,15.75 19.38,14.62 v20.25,14.62 | v6.38,17.12 6.62,17.38 | v4.12,8.38 4.12,10.5 3.75,10.88 3.75,14.88 2.12,16.5 2.12,17 2.5,17.38 6.62,17.38
PC6  (via drill 0.33)
  Top 0.152: 21.8,18.8 U1.37 v21.75,19.88 | P1.24 5.12,17.75 5.25,17.62 5.75,17.62 6.5,18.38 v6.5,18.77 | v13.75,18.75 12.5,18.75 11.88,18.75 11,19.62 v10.9,19.62
  Bottom 0.152: v6.5,18.77 6.58,18.7 9.47,18.7 10.4,19.62 v10.9,19.62 | v13.75,18.75 14.88,18.75 15.25,18.38 15.5,18.12 18,18.12 18.25,18.38 18.75,18.88 19,18.88 20.12,18.88 20.5,19.25 21.12,19.25 v21.75,19.88
PC7  (via drill 0.33)
  Top 0.152: 21.3,18.8 U1.38 21.25,19.5 v20.88,19.88
  Top 0.254: P1.26 5.45,18.25 v5.5,18.3
  Bottom 0.152: v5.5,18.3 5.67,18.12 6.75,18.12 6.89,18.26 | 6.89,18.26 6.92,18.3 | 6.92,18.3 9.55,18.3 10.12,18.88 10.5,18.88 10.62,19 13.18,19 13.2,19.02 13.5,19.32 14,19.32 14.25,19.07 15,19.07 15.57,18.5 15.68,18.5 15.75,18.5 17.88,18.5 18.62,19.25 20,19.25 20.62,19.88 v20.88,19.88 | 6.92,18.3 6.89,18.26
PC8  (via drill 0.33)
  Top 0.152: v2.88,17.98 2.88,17.77 2.1,17 2.1,16.4 2.9,15.6 2.9,14.7 3.3,14.3 3.35,14.25 P1.10 | U1.39 20.75,18.12 20.5,17.88 19.1,17.88 v18.12,16.9
  Bottom 0.152: v18.12,16.9 17.9,17.12 17.25,17.12 17,16.88 16.25,16.88 15,18.12 13.5,18.12 13,18.62 10.75,18.62 10.62,18.5 10.25,18.5 9.62,17.88 7,17.88 6.85,17.73 5.22,17.73 4.97,17.98 v2.88,17.98
PC9  (via drill 0.33)
  Top 0.152: v34.12,17.62 34.25,17.75 P2.10 | v23.9,20.68 23.07,20.68 22.62,21.12 22.12,21.12 21.5,20.5 20.5,20.5 20.25,20.25 U1.40
  Bottom 0.152: v34.12,17.62 33.88,17.62 33.5,18 33.38,18 32.75,18.62 32.75,18.75 32.38,19.12 31.5,19.12 30.62,20 30.25,20 30.2,20 29.3,20.9 24.7,20.9 24.4,20.6 23.98,20.6 v23.9,20.68
PC10
  Top 0.152: U1.51 13.03,15.75 12.85,15.93 11.93,15.93 11.5,16.35 11.07,16.35 10.1,17.32 9.6,17.32 8.68,18.25 7.83,18.25 P1.25
PC11
  Top 0.152: U1.52 13.07,15.25 12.72,15.6 11.8,15.6 11.38,16.02 10.95,16.02 9.97,17 9.47,17 8.72,17.75 7.83,17.75 P1.23
PC12
  Top 0.152: U1.53 13.12,14.75 12.6,15.28 11.68,15.28 11.25,15.7 10.82,15.7 9.85,16.68 9.35,16.68 8.78,17.25 7.83,17.25 P1.21
PC13  (via drill 0.33)
  Top 0.152: v5.58,13.25 P1.6 4.17,13.28 | U1.2 v16.75,6.12 | v35.35,4.15 35.35,9.55 37.12,11.32 37.58,11.32 38.02,11.78 38.02,14.07 v38.05,14.1 | v30.62,21.68 29.93,21.68 29.8,21.55 U4.5
  Bottom 0.152: 16.75,6.15 16.75,6.5 16.38,6.88 16.12,7.12 13.7,9.55 9.7,9.55 6,13.25 v5.58,13.25 5.5,13.25 | v16.75,6.12 16.75,6.15 | v16.75,6.12 16.75,6.15 | v35.35,4.15 35.35,3.27 34.5,2.42 33.73,2.42 33.48,2.17 32.73,2.17 32.65,2.25 28.93,2.25 27.75,3.42 26.73,3.42 25.93,3.42 23.5,3.42 21.5,5.42 21.43,5.42 20,5.42 19.45,5.97 19.18,6.25 16.82,6.25 v16.75,6.12 | v38.05,14.1 38.42,14.1 39.1,14.78 39.1,18.77 37.3,20.57 37.3,20.95 36.85,21.4 36.85,21.85 36.4,22.3 31.25,22.3 v30.62,21.68
PD2
  Top 0.152: U1.54 14.18,14.25 13.18,14.25 12.47,14.95 11.55,14.95 11.12,15.38 10.7,15.38 9.72,16.35 9.22,16.35 8.82,16.75 7.83,16.75 P1.19
PWR_ON  (via drill 0.33)
  Top 0.152: v33.5,14.75 33.5,18.7 33.77,18.98 v33.8,18.98 | v37.12,13.25 37,13.25 P2.28 | v31.43,20.52 30.95,21 28.3,21 28.12,21.18 28.12,22.38 27.65,22.85 v27.62,22.85 | v6.25,20.5 6.75,20.5 7.22,20.98 7.22,21.2 8.7,22.68 10.43,22.68 v10.47,22.73 | v36.25,21.62 37.5,22.88 37.5,23.38 37.75,23.62 37.75,24.75 37.75,25.75 38.5,25.75 | 38.5,25.75 SW2(PWR).1 38.5,25.75 | P1.28 3,18.75 v2.88,18.88
  Top 0.254: U4.2 v27.62,22.85
  Bottom 0.152: v6.25,20.5 5.62,20.5 4,18.88 v2.88,18.88 | v31.43,20.52 31.35,20.52 31.35,20.35 31.8,19.9 32.6,19.9 33.5,19 33.52,18.98 v33.8,18.98 33.8,18.95 34,18.75 34.5,18.75 36.25,20.5 v36.25,21.62 | v33.5,14.75 34.5,14.75 36,13.25 v37.12,13.25 | v27.62,22.85 27.43,22.65 27.4,22.65 27.35,22.65 24.85,22.65 24.25,23.25 23.75,23.25 23.38,22.88 20.68,22.88 20.18,22.38 16.25,22.38 15.62,23 13.7,23 12.8,23 12.47,23.32 11.62,23.32 11.07,23.32 v10.47,22.73
RESET#  (via drill 0.33)
  Top 0.152: 19.3,7.3 U1.7 19.25,8 18.88,8.38 v18.88,9.12 | P2.1 31.25,19.75 31.12,19.88 30.5,19.88 30.12,19.5 30.12,19.25 29.75,18.88 v29.12,18.88 | v21.88,17.12 21.62,17.12 20.75,16.25 19.45,16.25 18.38,15.18 18.38,13 17.75,12.38 17.75,11.28 v17.52,11.05 | v7.62,9.47 7.62,11 7.62,11.62 7.62,12.25 7.75,12.25 P1.1 7.88,12.25 8.53,12.25 8.55,12.28 8.85,12.28 8.95,12.38 v9.45,12.38 | RESET.1 9.7,1.48 | R1.1 C21.1 9.72,1.48 RESET.1 | v9.75,3.88 9.75,2 9.7,1.95 RESET.1
  Bottom 0.152: v29.12,18.88 27.88,17.62 22.5,17.62 22,17.12 v21.88,17.12 | v18.88,9.12 17.52,10.47 v17.52,11.05 15.53,11.05 15.15,10.68 15.05,10.57 14.97,10.57 10.12,10.57 9.45,11.25 9.45,11.28 v9.45,12.38 | v9.75,3.88 7.62,6 7.62,7 v7.62,9.47
RSV0
  Top 0.152: RSV0.P$1 30.88,19.25 32.12,19.25 P2.3
RSV1
  Top 0.152: P2.5 32.12,18.75 31.25,18.75 31.12,18.62 31,18.62 30.62,18.25 30.5,18.25 RSV1.P$1
RSV2
  Top 0.152: P2.17 32.12,15.75 31.38,15.75 30.62,15 30.25,15 29.75,15 28.88,14.12 RSV2.P$1
RSV3
  Top 0.152: RSV3.P$1 30.25,14.12 31.38,15.25 32.12,15.25 P2.19
STAT  (via drill 0.33)
  Top 0.152: v24,27.88 21.62,27.88 20.57,26.82 U3.1 | R8.2 27.82,29 28,29.18 v28,29.88
  Bottom 0.152: v24,27.88 24,29.75 25.02,30.77 25.73,30.77 25.93,30.57 26.55,30.57 27.15,29.98 27.15,29.88 27.18,29.85 27.98,29.85 v28,29.88
VBAT  (via drill 0.33)
  Top 0.305: v7.88,24.75 CN1.1 6.38,24.75 | v20.93,24.93 U3.3 18.48,24.93 C20.1 | Q2.3 v22.65,29.88
  Bottom 0.305: v7.88,24.75 10.78,24.75 11.55,25.52 11.57,25.52 20.32,25.52 v20.93,24.93 21.25,24.6 22.71,24.6 23.29,25.18 23.29,29.24 v22.65,29.88
VCC  (via drill 0.33)
  Top 0.152: 19.38,22.75 19.35,22.73 U2.3 | v3.52,10.18 3.52,9.3 3.55,9.28 R15.1
  Top 0.305: P2.30 35.88,12.75 35.88,12.25 P2.32 v37.12,12.25 | v5.75,19.75 P1.32 P1.30 | v33.77,26.5 33.6,26.68 33.6,29.77 Q1.3 33.4,29.98 v33.4,30.98 | 19.38,22.75 v19.38,24.05
  Bottom 0.152: 6.88,19.75 6.88,19.88 6.88,20.75 6.12,21.5 4.12,21.5 2.25,19.62 2.25,17.62 1.75,17.12 1.75,16.38 3.38,14.75 3.42,14.7 3.42,10.75 3.52,10.65 v3.52,10.18
  Bottom 0.305: 33.77,26 25.25,26 23.3,24.05 v19.38,24.05 18.43,25 11.75,25 9.5,22.75 9.5,21.48 7.78,19.75 6.88,19.75 v5.75,19.75 | 33.77,26 38.38,26 39.5,24.88 39.5,14.62 v37.12,12.25 | 33.77,26 v33.77,26.5
VCC_3V3  (via drill 0.33)
  Top 0.152: 32.25,12.25 P2.31 | 7.5,19.75 P1.31 | 24.5,4.62 C1.1 24.65,4.65 25.23,4.65 25.25,4.62 25.25,4.08 25.38,3.95 28.88,3.95 30.3,2.52 30.3,2.3 | R3.2 31,27 31,26 31.12,25.88 31.25,25.88 31.5,25.88 31.88,25.5 31.93,25.45 v31.93,25 | v14.62,3.75 14.62,3 14.5,2.88 14.62,2.75 R14.1 14.62,3.27 R1.2 | 30.3,2.3 BOOT0.2 30.3,2.3 | v34.33,3.08 34.33,4.7 34.4,4.78 R13.2 | v32.98,2.75 32.98,2.6 32.67,2.3 30.3,2.3
  Top 0.254: v22.95,8.91 22.25,8.21 U1.13 22.25,7.12 22.25,6.5 22.75,6 22.75,4.75 C4.1 | P1.29 P1.31 9.15,19.75 9.25,19.75 arc90 v9.28,19.77 | 32.12,12.25 P2.31 | 22.19,23.52 C11.1 | 29.05,11.68 28.9,11.68 C17.1 | P2.31 31.12,12.25 30.34,11.46 C3.1 C17.1 | v16.5,21.75 16.38,21.62 15.88,21.62 15.65,21.62 C18.1 | 14.88,20.88 C18.1 | C18.1 C6.1 arc-90 13,20.6 12.8,20.6 12.18,20.6 v12.15,20.6 | v16.46,9.38 16.46,9.36 16.35,9.25 U1.64 14.12,9.25 12.32,9.25 11.97,9.6 C2.1 | v24.07,10.18 arc-90 24.15,10.25 U1.19 26.75,10.25 28.18,11.68 28.45,11.4 C17.1 | P2.29 P2.31 | v16.6,17.55 16.25,17.9 U1.48 16.25,19.4 15.18,20.48 14.88,20.77 C18.1 | C23.1 C2.1 | C2.1 10.75,9.6 v10.75,8.62
  Top 0.305: U1.32 25.88,16.75 26,16.88 C5.1 | 21.53,23.65 21.62,23.75 21.94,23.75 U2.2 | 21.53,23.65 20.75,22.88 20.62,22.75 v20.62,21.93 | 22.19,23.52 21.66,23.52 21.53,23.65 | v24.75,24.12 24.15,23.52 C11.1 | C1.1 C4.1
  Top 0.406: v26,18.88 C5.1 C19.1
  Bottom 0.152: v10.75,8.62 10.75,7.62 v14.62,3.75 | v34.33,3.08 34,2.75 33.75,2.75 v32.98,2.75
  Bottom 0.254: v9.28,19.77 10.1,20.6 11.97,20.6 v12.15,20.6
  Bottom 0.305: v24.75,24.12 25.62,25 v31.93,25 | v20.62,21.93 16.68,21.93 v16.5,21.75
  Bottom 0.406: 20.48,17.6 21.38,18.5 25.5,18.5 25.62,18.5 v26,18.88 | 20.48,17.6 20.48,16.02 22.38,14.12 22.38,12.38 23.38,11.38 23.38,10.12 | 23.38,10.12 23.38,9.34 v22.95,8.91 21.41,7.38 21.12,7.38 21.07,7.38 21.05,7.38 17.77,7.38 17.77,7.4 16.46,8.71 v16.46,9.38 | v24.07,10.18 23.43,10.18 23.38,10.12 | v16.6,17.55 16.65,17.6 20.48,17.6
VCC_BKUP
  Top 0.152: U1.1 16.25,6.5 15,5.25 15,4.62 14.62,4.62 R14.2
VCC_SEL  (via drill 0.33)
  Top 0.152: R7.1 32.88,25 32.88,28.25 32.25,28.88 32.2,28.93 Q1.2
  Top 0.305: 25.5,30.85 D5.C | v26.88,26.75 26.88,26.25 26.75,26.12 26.75,23.62 26.62,23.5 26.5,23.5 U4.1 | v25.38,29.88 25.38,30.77 D5.C | Q2.2 25.43,30.82 D5.C | v30.1,28.9 30.12,28.93 Q1.2
  Bottom 0.305: v25.38,29.88 26,29.88 26.75,29.12 26.88,29 | 26.88,26.88 v26.88,26.75 26.88,29 | 26.88,29 26.98,28.9 v30.1,28.9
VCC_USB  (via drill 0.33)
  Top 0.305: v17.75,30.25 17.38,30.25 F1.1 | 11.3,26.68 v11.32,26.68 U$1.1
  Bottom 0.305: v17.75,30.25 17.75,30 15.38,27.62 15.25,27.5 14.12,27.5 13.3,26.68 v11.32,26.68
VCC_USBF  (via drill 0.33)
  Top 0.152: R10.1 16,26.52 v15,26.52 | D3.A 27.12,30.02 27,29.9 26.52,29.9 26.38,29.75 26.38,28.62 D5.A
  Top 0.305: v18.75,30.25 19.62,30.25 F1.2 | v22.25,25.82 22.43,25.65 U3.4 | v22.32,28.62 22.62,28.93 Q2.1 24.27,28.93 D5.A | v15,26.52 14.95,26.48 C16.1
  Bottom 0.305: v15,26.52 15.53,26.52 16.5,27.5 16.5,28 17.12,28.62 v18.75,30.25 20.82,30.25 21.95,29.12 22.32,28.75 v22.32,28.62 22.32,26.02 22.32,25.9 v22.25,25.82

### Text on the board
tNames: MatchBox / V1.2